# EAGLE design tx-warmer-smd (EAGLE 6.5.0)
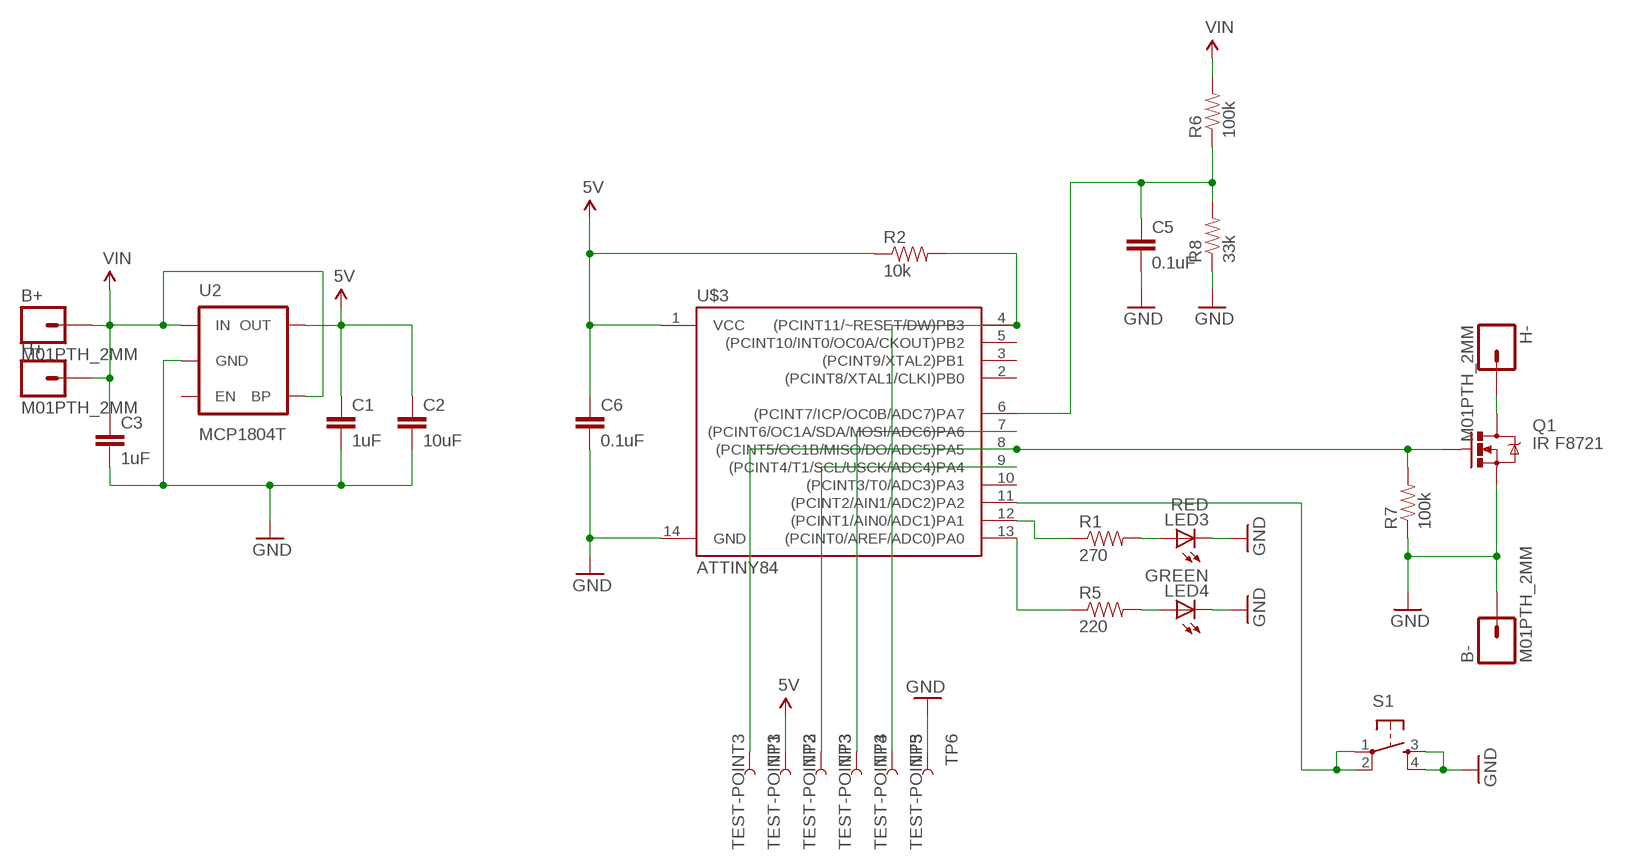
[diagram p0: schematic, sheet 1]

## Parts
B+  M01PTH_2MM  [1X01_2MM]
B-  M01PTH_2MM  [1X01_2MM]
C1  1uF  CAP0805  [0805]
C2  10uF  CAP0805  [0805]
C3  1uF  CAP0805  [0805]
C5  0.1uF  CAP0805  [0805]
C6  0.1uF  CAP0805  [0805]
H+  M01PTH_2MM  [1X01_2MM]
H-  M01PTH_2MM  [1X01_2MM]
LED3  RED  LED1206  [LED-1206]
LED4  GREEN  LED1206  [LED-1206]
Q1  IR F8721  MOSFET-NCHANNELFDS6630A  [SO08]
R1  270  RESISTOR0805-RES  [0805]
R2  10k  RESISTOR0805-RES  [0805]
R5  220  RESISTOR0805-RES  [0805]
R6  100k  RESISTOR0805-RES  [0805]
R7  100k  RESISTOR0805-RES  [0805]
R8  33k  RESISTOR0805-RES  [0805]
S1  TAC_SWITCHSMD  [TACTILE_SWITCH_SMD]
TP1  TEST-POINT3  [PAD.03X.03]
TP2  TEST-POINT3  [PAD.03X.03]
TP3  TEST-POINT3  [PAD.03X.03]
TP4  TEST-POINT3  [PAD.03X.03]
TP5  TEST-POINT3  [PAD.03X.03]
TP6  TEST-POINT3  [PAD.03X.03]
U2  MCP1804T  V_REG_LDOSMD  [SOT23-5]
U$3  ATTINY84  [SO14]

## Nets
5V: C1.1 C2.1 C6.1 R2.1 TP2.P$1 U2.5(OUT) U$3.1(VCC)
GND: B-.1 C1.2 C2.2 C3.2 C5.2 C6.2 LED3.C LED4.C Q1.1(S) Q1.2(S) Q1.3(S) R7.1 R8.1 S1.3 S1.4 TP6.P$1 U2.2(GND) U$3.14(GND)
N$1: S1.1 S1.2 U$3.11((PCINT2/AIN1/ADC2)PA2)
N$3: C5.1 R6.1 R8.2 U$3.6((PCINT7/ICP/OC0B/ADC7)PA7)
N$4: TP4.P$1 U$3.7((PCINT6/OC1A/SDA/MOSI/ADC6)PA6)
N$5: TP3.P$1 U$3.9((PCINT4/T1/SCL/USCK/ADC4)PA4)
N$8: Q1.4(G) R7.2 TP1.P$1 U$3.8((PCINT5/OC1B/MISO/DO/ADC5)PA5)
N$11: R1.1 U$3.12((PCINT1/AIN0/ADC1)PA1)
N$12: H-.1 Q1.5(D) Q1.6(D) Q1.7(D) Q1.8(D)
N$22: R5.1 U$3.13((PCINT0/AREF/ADC0)PA0)
N$23: R2.2 TP5.P$1 U$3.4((PCINT11/~RESET/DW)PB3)
N$24: LED3.A R1.2
N$25: LED4.A R5.2
VIN: B+.1 C3.1 H+.1 R6.2 U2.1(IN) U2.4(BP)
Unconnected: U2.3(EN) U$3.2((PCINT8/XTAL1/CLKI)PB0) U$3.3((PCINT9/XTAL2)PB1) U$3.5((PCINT10/INT0/OC0A/CKOUT)PB2) U$3.10((PCINT3/T0/ADC3)PA3)

## Library data of the parts
B+ B- H+ H- = SparkFun-Connectors:M01: Header 1 Standard 1-pin 0.1" header. Use with straight break away headers (SKU : PRT-00116), right angle break away headers (PRT-00553), swiss pins (PRT-00743), machine pins (PRT-00117), and female headers (PRT-00115).
C1-C3 C5 C6 = SparkFun-Capacitors:CAP: Capacitor Standard 0603 ceramic capacitor, and 0.1" leaded capacitor.
LED3 LED4 = SparkFun-LED:LED: LEDs Standard schematic elements and footprints for 5mm, 3mm, 1206, and 0603 sized LEDs. 5mm - Spark Fun Electronics SKU : COM-00529 (and others)
Q1 = SparkFun-DiscreteSemi:MOSFET-NCHANNEL: Common NMOSFET Parts MFG P/N Store ID Prod ID FDD8780 TRANS-09984 SI7820DN TRANS-11055 FDS6630A IC-08089 2N7002PW TRANS-11151 FQP30N06L COM-10213 TRANS-10060 BSS123LT1G TRANS-08345 BSS138 TRANS-00830 BS170 2N7000; PROD_ID: IC-08089
R1 R2 R5-R8 = SparkFun-Resistors:RESISTOR: Resistor Basic schematic elements and footprints for 0603, 1206, and PTH resistors.
S1 = SparkFun-Electromechanical:TAC_SWITCH: Momentary Switch Button commonly used for reset or general input. Spark Fun Electronics SKU : COM-00097 SMT- SWCH-08247; PROD_ID: SWCH-08247
TP1-TP6 = SparkFun-Passives:TEST-POINT: Bare copper test points for troubleshooting or ICT
U2 = SparkFun-PowerIC:V_REG_LDO: Voltage Regulator LDO Standard 150mA LDO voltage regulator in SOT-23 layout. Micrel part MIC5205. BP (by-pass) pin is used to lower output noise with 470pF cap.
U$3 = SparkFun-DigitalIC:ATTINY84: Atmel 14-pin 2/4/8kB flash uC

## Net classes
0 default: width 0.406 mm

## Board
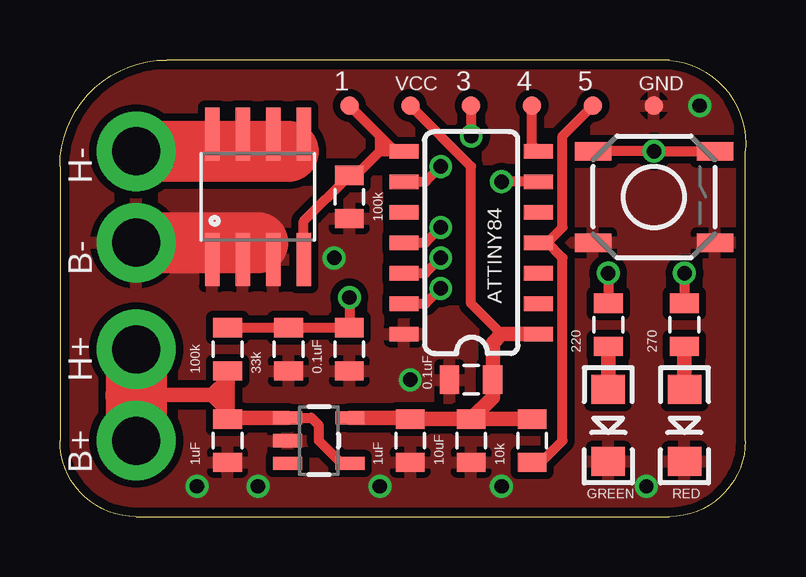
[diagram p1: board, top side]
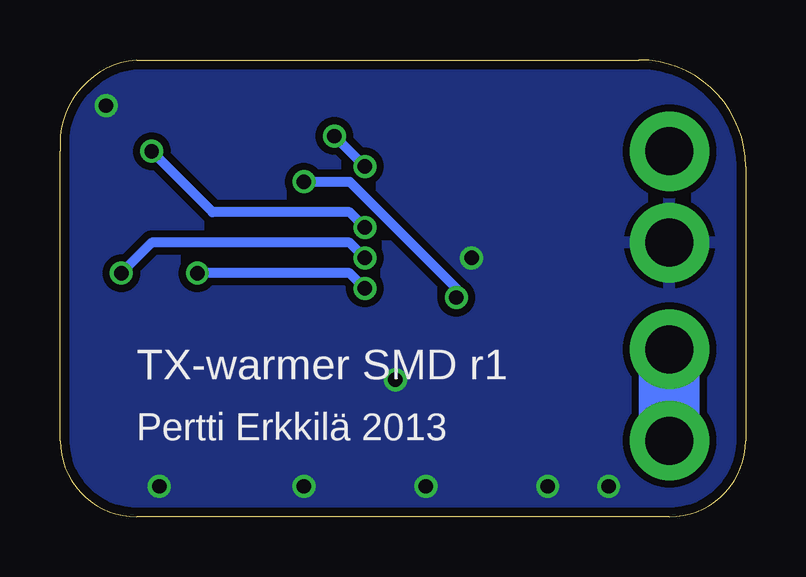
[diagram p2: board, bottom side, seen from below]

Size 28.59 x 19.05 mm. Coordinates in mm from the lower left corner, seen from the top.
Outline: 3.17,0 25.4,0 arc90 28.58,3.17 28.58,15.24 arc90 25.4,19.05 4.45,19.05 arc90 0,14.6 0,3.17 arc90 3.17,0
Copper layers (1*16): Top 0.0356mm / dielectric 1.5011mm / Bottom 0.0356mm
Design rules "LaenPCBOrder": minimum track width 6mil, minimum drill 13mil, track to track 6mil, track to pad 6mil, pad to pad 6mil, via to via 6mil, smd to smd 6mil, copper to edge 15mil, drill to drill 6mil, minimum pad ring 7mil, minimum via ring 7mil, stop-mask expansion 4mil, vias tented up to drill 0mil, thermal gap 10mil

### Footprints (pad centres in the part's own frame; a part is rotated, then mirrored left to right if it is on the bottom)
1X01_2MM = drill 2 pad 3.302: 1 0,0
0805 = smd 0.8 x 1.2: 1 -0.9,0; 2 0.9,0
LED-1206 = smd 1.2 x 1.4: A -1.5,0; C 1.5,0
SO08 = smd 0.61 x 2.21: 1 -1.905,-2.616; 2 -0.635,-2.616; 3 0.635,-2.616; 4 1.905,-2.616; 5 1.905,2.616; 6 0.635,2.616; 7 -0.635,2.616; 8 -1.905,2.616
TACTILE_SWITCH_SMD = smd 1.524 x 0.762: 1 -2.54,1.905; 2 2.54,1.905; 3 -2.54,-1.905; 4 2.54,-1.905
PAD.03X.03 = smd 0.762 x 0.762: P$1 0,0
SOT23-5 = smd 0.55 x 1.2: 1 -0.95,-1.3; 2 0,-1.3; 3 0.95,-1.3; 4 0.95,1.3; 5 -0.95,1.3
SO14 = smd 0.6 x 1.2: 1 -3.81,-2.8; 2 -2.54,-2.8; 3 -1.27,-2.8; 4 0,-2.8; 5 1.27,-2.8; 6 2.54,-2.8; 7 3.81,-2.8; 8 3.81,2.8; 9 2.54,2.8; 10 1.27,2.8; 11 0,2.8; 12 -1.27,2.8; 13 -2.54,2.8; 14 -3.81,2.8

### Placement (x,y rotation side)
B+  3.17,3.17 0 top
B-  3.17,11.43 0 top
C1  14.61,3.17 270 top
C2  17.15,3.17 270 top
C3  6.98,3.17 270 top
C5  12.06,6.98 270 top
C6  17.15,5.71 180 top
H+  3.17,6.98 0 top
H-  3.17,15.24 0 top
LED3  26.04,3.81 270 top
LED4  22.86,3.81 270 top
Q1  8.26,13.33 0 top
R1  26.04,8 270 top
R2  19.69,3.17 270 top
R5  22.86,8 270 top
R6  6.98,6.98 270 top
R7  12.06,13.33 90 top
R8  9.53,6.98 90 top
S1  24.77,13.33 0 top
TP1  12.06,17.14 0 top
TP2  14.61,17.14 0 top
TP3  17.15,17.14 0 top
TP4  19.69,17.14 0 top
TP5  22.23,17.14 0 top
TP6  24.77,17.14 0 top
U2  10.79,3.17 270 top
U$3  17.15,11.43 90 top

### Tracks (layer width: path | path; a pad name or v marks a point on that pad's centre or on a via)
5V
  Top 0.406: 18.42,7.62 17.15,8.89 17.15,14.6 TP2.P$1
  Top 0.61: U2.5 14.55,4.12 C1.1 C2.1 | C2.1 R2.1 | C2.1 18.05,4.97 C6.1 18.05,7.25 18.42,7.62 U$3.1
GND  (via drill 0.6)
  Top 2.54: B-.1 8.26,11.43
  other vias: 14.61,5.71 11.43,10.79 26.67,17.14 5.71,1.27 8.26,1.27 13.33,1.27 18.42,1.27 24.45,1.27
  pour Top (isolate 0.305): -0.64,19.69 29.21,19.69 29.21,-0.64 -0.64,-0.64
  pour Bottom (isolate 0.305): -1.27,20.32 29.85,20.32 29.85,-1.27 -1.27,-1.27
N$1  (via drill 0.6)
  Top 0.406: U$3.11 15.24,11.43 v15.88,12.06 | S1.2 v24.77,15.24 S1.1
  Bottom 0.406: v15.88,12.06 16.51,12.7 22.23,12.7 v24.77,15.24
N$3  (via drill 0.6)
  Top 0.406: R6.1 R8.2 C5.1 v12.06,9.14 | U$3.6 v18.42,13.97
  Bottom 0.406: v18.42,13.97 16.51,13.97 12.06,9.53 v12.06,9.14
N$4
  Top 0.406: TP4.P$1 19.69,15.5 U$3.7
N$5  (via drill 0.6)
  Top 0.406: U$3.9 15.24,13.97 v15.88,14.6 | TP3.P$1 v17.15,15.87
  Bottom 0.406: v17.15,15.87 v15.88,14.6
N$8
  Top 0.406: Q1.4 10.16,12.33 R7.2 12.33,14.23 13.33,15.24 | 13.97,15.24 13.33,15.87 | 13.33,15.87 TP1.P$1 | 13.33,15.24 13.97,15.24 | 13.97,15.24 U$3.8 | 13.33,15.24 13.33,15.87
N$11  (via drill 0.6)
  Top 0.406: U$3.12 15.24,10.16 v15.88,10.79 | v26.04,10.16 R1.1
  Bottom 0.406: v26.04,10.16 24.77,11.43 16.51,11.43 v15.88,10.79
N$12
  Top 0.406: Q1.7 7.62,15.87 | 9.53,15.24 Q1.5 Q1.6 Q1.7 | Q1.7 Q1.8 3.25,15.95 H-.1
  Top 2.54: H-.1 9.53,15.24
N$22  (via drill 0.6)
  Top 0.406: U$3.13 15.24,8.89 v15.88,9.53 | v22.86,10.16 R5.1
  Bottom 0.406: v15.88,9.53 16.51,10.16 v22.86,10.16
N$23
  Top 0.406: R2.2 20.06,2.27 20.96,3.17 20.96,10.79 20.32,11.43 | 20.32,11.43 20.96,12.06 20.96,15.87 TP5.P$1 | 20.32,11.43 U$3.4
N$24
  Top 0.61: R1.2 LED3.A
N$25
  Top 0.61: R5.2 LED4.A
VIN
  Top 0.406: U2.4 11.74,2.22 10.79,3.17 10.79,3.81 10.48,4.12 U2.1
  Top 0.61: U2.1 7.04,4.12 C3.1 6.98,4.44 | R6.2 6.98,5.71 | 6.98,5.71 6.98,5.08 | 6.98,5.08 6.35,5.08 | 6.35,5.08 3.17,5.08 | 6.35,5.08 6.98,4.44 | 6.98,4.44 6.98,5.08 | 6.98,5.71 6.35,5.08
  Top 2.54: H+.1 3.17,5.08 B+.1
  Bottom 2.54: B+.1 H+.1

### Text on the board
bPlace: TX-warmer SMD r1 | Pertti Erkkilä 2013
tNames: 1 | VCC | 3 | 4 | 5 | GND